# EAGLE schematic fuente2 - copia (EAGLE 6.5.0)
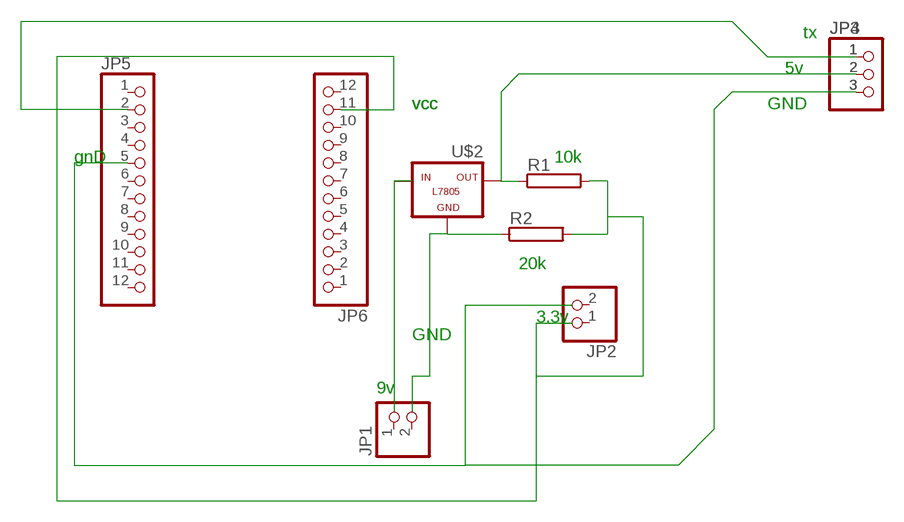
[diagram p0: schematic, sheet 1]

## Parts
JP1  PINHD-1X2  [1X02]
JP2  PINHD-1X2  [1X02]
JP3  PINHD-1X3  [1X03]
JP4  PINHD-1X3  [1X03]
JP5  PINHD-1X12  [1X12]
JP6  PINHD-1X12  [1X12]
R1  RCA4050  [CA4050]
R2  RCA4050  [CA4050]
U$2  -L7805  [L7805]

## Nets
N$3: R2.1 U$2.GND
N$7: JP3.1 JP4.1 JP5.2
N$32: JP3.2 JP4.2 R1.1 U$2.OUT
N$33: JP6.11 R1.2 R2.2
N$34: JP3.3 JP4.3 JP5.5
Unconnected: JP1.1 JP1.2 JP2.1 JP2.2 JP5.1 JP5.3 JP5.4 JP5.6 JP5.7 JP5.8 JP5.9 JP5.10 JP5.11 JP5.12 JP6.1 JP6.2 JP6.3 JP6.4 JP6.5 JP6.6 JP6.7 JP6.8 JP6.9 JP6.10 JP6.12 U$2.IN

## Notes on the sheet
- tx
- 5v
- vcc | vcc | GND
- gnD | 10k
- 20k
- 3.3v
- GND
- 9v

## Library data of the parts
JP1 JP2 = pinhead:PINHD-1X2: PIN HEADER
JP3 JP4 = pinhead:PINHD-1X3: PIN HEADER
JP5 JP6 = pinhead:PINHD-1X12: PIN HEADER
R1 R2 = resistor-power:R: Power Resitor; OC_FARNELL: unknown; OC_NEWARK: unknown
U$2 = tango (1):-L7805